# EAGLE design Adafruit Feather M0 Basic rev C (EAGLE 8.3.1)
COMPANY: ADAFRUIT INDUSTRIES; DRAWN: KTOWN; REV: B
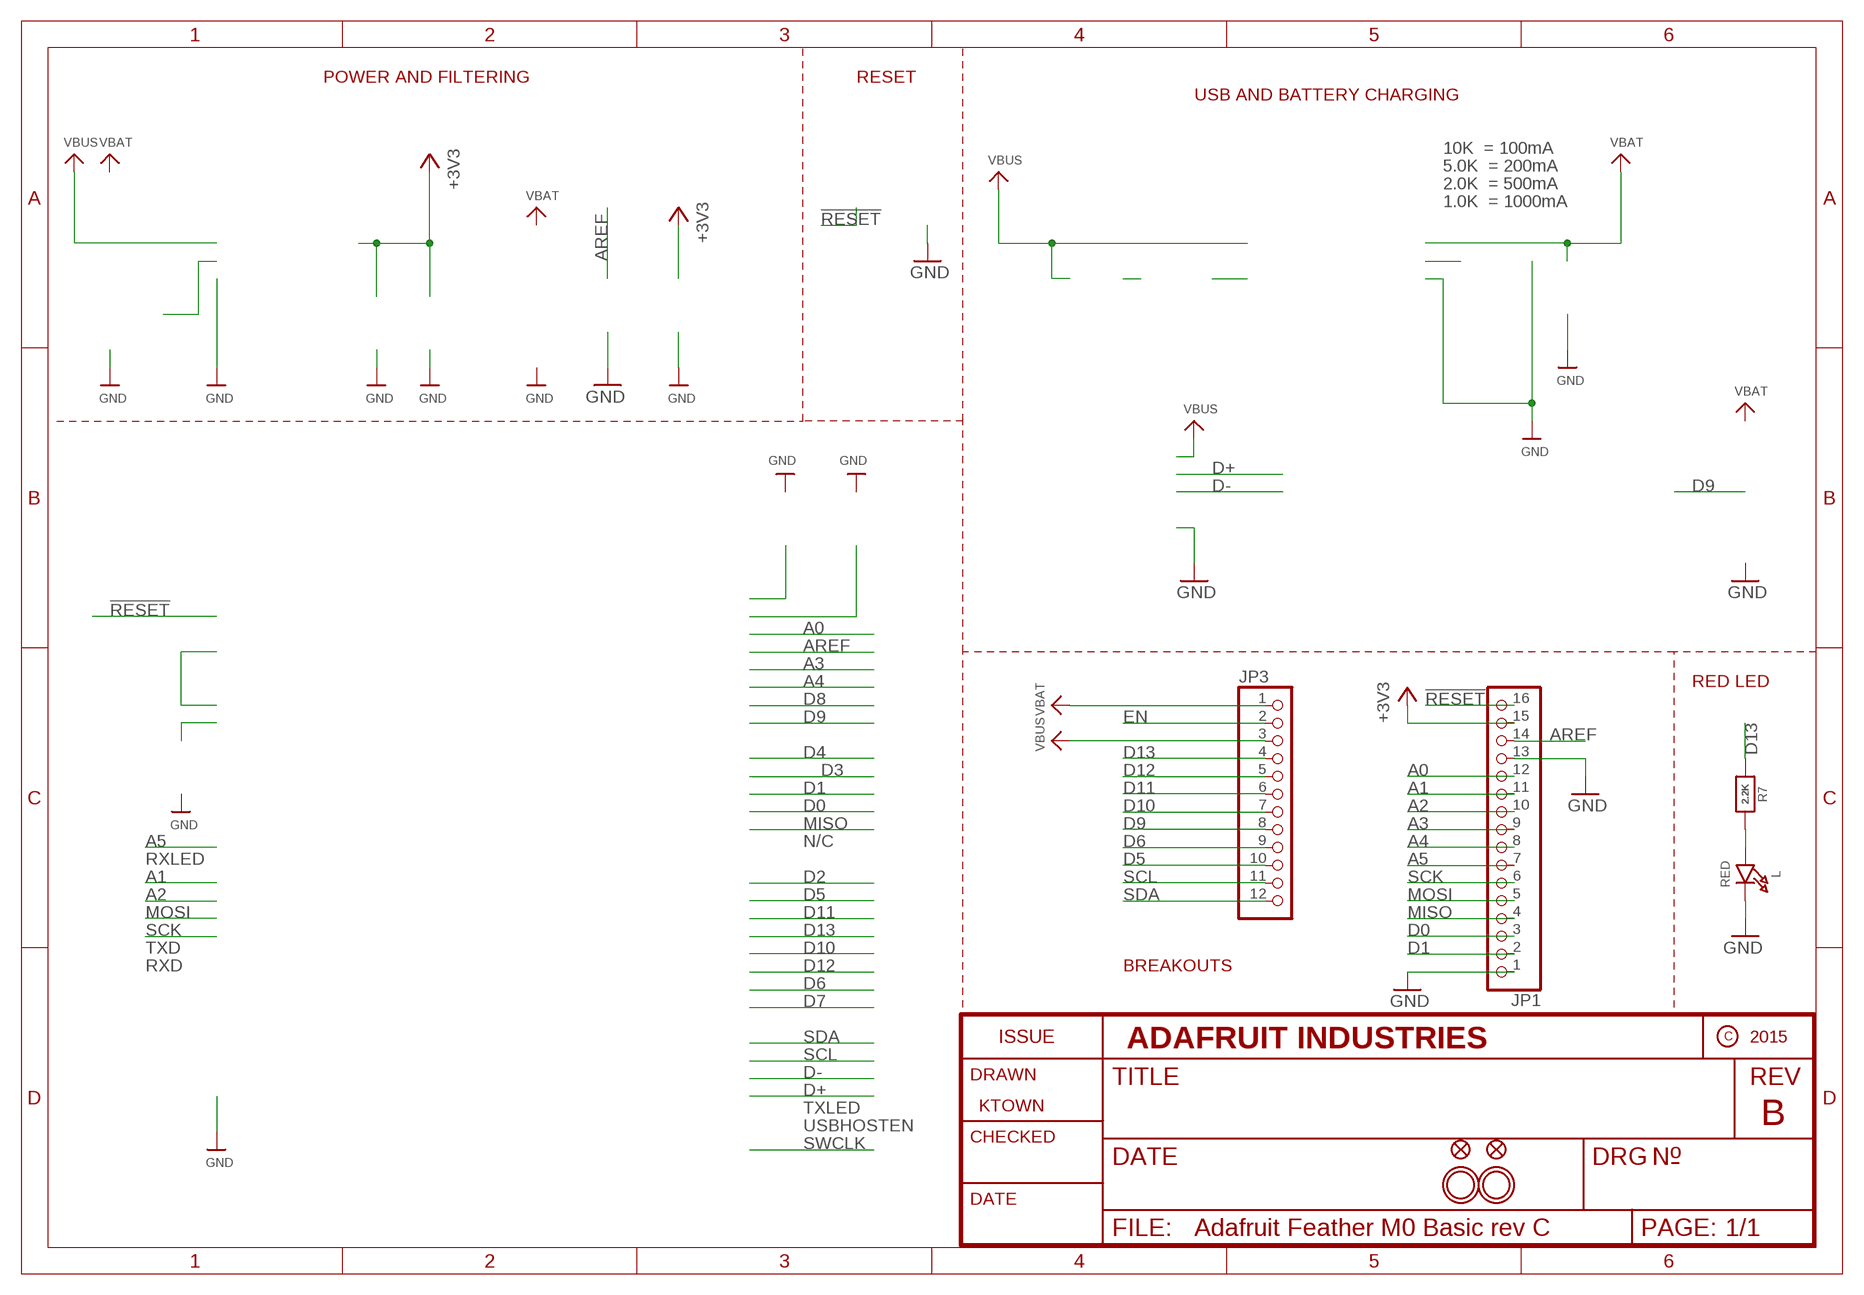
[diagram p0: schematic, sheet 1]

## Parts
JP1  HEADER-1X16ROUND  [1X16_ROUND]
JP3  HEADER-1X12  [1X12_ROUND]
L  RED  LED0805_NOOUTLINE  [CHIPLED_0805_NOOUTLINE]
R7  2.2K  RESISTOR_0603_NOOUT  [0603-NO]
U$31  MOUNTINGHOLE2.5  [MOUNTINGHOLE_2.5_PLATED]
U$32  MOUNTINGHOLE2.5  [MOUNTINGHOLE_2.5_PLATED]
U$34  FIDUCIAL""  [FIDUCIAL_1MM]
U$35  FIDUCIAL""  [FIDUCIAL_1MM]

## Nets
!RESET: JP1.16
+3V3: JP1.15
A0: JP1.12
A1: JP1.11
A2: JP1.10
A3: JP1.9
A4: JP1.8
A5: JP1.7
AREF: JP1.14
D0: JP1.3
D1: JP1.2
D5: JP3.10
D6: JP3.9
D9: JP3.8
D10: JP3.7
D11: JP3.6
D12: JP3.5
D13: JP3.4 R7.1
EN: JP3.2
GND: JP1.1 JP1.13 L.C
MISO: JP1.4
MOSI: JP1.5
N$2: L.A R7.2
SCK: JP1.6
SCL: JP3.11
SDA: JP3.12
VBAT: JP3.1
VBUS: JP3.3

## Notes on the sheet
- POWER AND FILTERING | RESET
- USB AND BATTERY CHARGING
- 10K  = 100mA
- 5.0K  = 200mA
- 2.0K  = 500mA
- 1.0K  = 1000mA
- RED LED
- N/C
- RXLED
- TXD
- RXD | BREAKOUTS
- TXLED
- USBHOSTEN

## Library data of the parts
JP1 = microbuilder:HEADER-1X16: PIN HEADER
JP3 = microbuilder:HEADER-1X12
L = microbuilder:LED: LED 0603 - 0603 Surface Mount Package 2mA: Green LED - Low Power (3.9mcd, 2ma, 1.7Vf) - Digikey: 475-2709-2-ND Orange LED - Low Power (9.8mcd, 2ma, 1.8Vf) - Digikey: 475-1194-2-ND Red LED - Low Power (5mcd, 2ma, 1.8Vf) - Digikey: 475-1195-2-ND Yellow LED - Low Power (7mcd, 2ma, 1.8Vf) - Digikey: 475-1196-2-ND 5mA: Blue LED - Low Power (17mcd, 5ma, 2.9Vf) - Digikey: LNJ937W8CRACT-ND 0805 - 0805 Surface Mount Package 2mA: Red LED (8.8mcd, 2mA, 1.8Vf, Clear) - Low Power [Digikey: 475-2510-1-ND] Green LED (5mcd, 2mA, 1.8Vf, Clear) - Low Power [Digikey: 475-2730-1-ND] Yellow LED (11.3mcd, 2mA, 1.8Vf, Clear) - Low Power [Digikey: 475-2555-1-ND] 20mA: Red LED (104mcd, 20mA, Diffused) - LS R976 [Digikey: 475-1278-6-ND] Red LED (12mcd, 20mA, 2.0Vf, Clear) - APT2012EC [Digikey: 754-1128-1-ND] Green LED (15mcd, 20mA, 2.2Vf, Clear) - APT2012GC [Digikey: 754-1131-1-ND] Orange LED (160mcd, 20mA, 2.1Vf, Clear) - APT2012SECK [Digikey: 754-1130-1-ND] 1206 - 1206 Surface Mount Package Green LED (26mcd, 20mA, Diffused) - LG N971 [Digikey: 475-1407-6-ND] Red LED (15mcd, 20mA, Diffused) - LH N974 [Digikey: 475-1416-6-ND] Cree - Cree High-Power Surface Mount LEDs XPEBWT-L1-0000-00D50 - White 111lm 350mA 2.9Vf 6200K 110° XTEAWT-00-0000-00000LEE3 - White 114lm 350mA 2.85Vf 5000K 115° Everlight - Everlight 45-21 Series Surface Mount LEDs 45-21/QK2C-B2832AC2CB2/2T - Warm White 2000mcd 20mA 3.25Vf 3050K 120° 45-21/LK2C-B38452C4CB2/2T - Nuetral White 2000mcd 20mA 3.25Vf 4150K 120° 45-21/LK2C-B50634C6CB2/2T - Cold White 2200mcd 20mA 3.25Vf 5650K 120° PLCC2 Reverse Mount LS T77K-J1L2-1-0-2-R18-Z - Red 11.25mcd 2mA 1.8Vf 630nm 120° LO T77K-L1M2-24-Z - Orange 19.6mcd 2mA 1.8Vf 606nm 120° LY T77K-K2M1-26-Z - Yellow 15.7mcd 2mA 1.8Vf 587nm 120°
R7 = microbuilder:RESISTOR: Resistors For new designs, use the packages preceded by an '_' character since they are more reliable: The following footprints should be used on most boards: _0402 - Standard footprint for regular board layouts _0603 - Standard footprint for regular board layouts _0805 - Standard footprint for regular board layouts _1206 - Standard footprint for regular board layouts For extremely tight-pitch boards where space is at a premium, the following 'micro-pitch' footprints can be used (smaller pads, no silkscreen outline, etc.): _0402MP - Micro-pitch footprint for very dense/compact boards _0603MP - Micro-pitch footprint for very dense/compact boards _0805MP - Micro-pitch footprint for very dense/compact boards _1206MP - Micro-pitch footprint for very dense/compact boards
U$31 U$32 = microbuilder:MOUNTINGHOLE: Mounting Hole For #2 screws (0.086"/2.18mm width, 0.094"/2.4mm hole) use 2.5mm; BOM: EXCLUDE
U$34 U$35 = microbuilder:FIDUCIAL: Fiducial Alignment Points Various fiducial points for machine vision alignment.; BOM: EXCLUDE

## Board
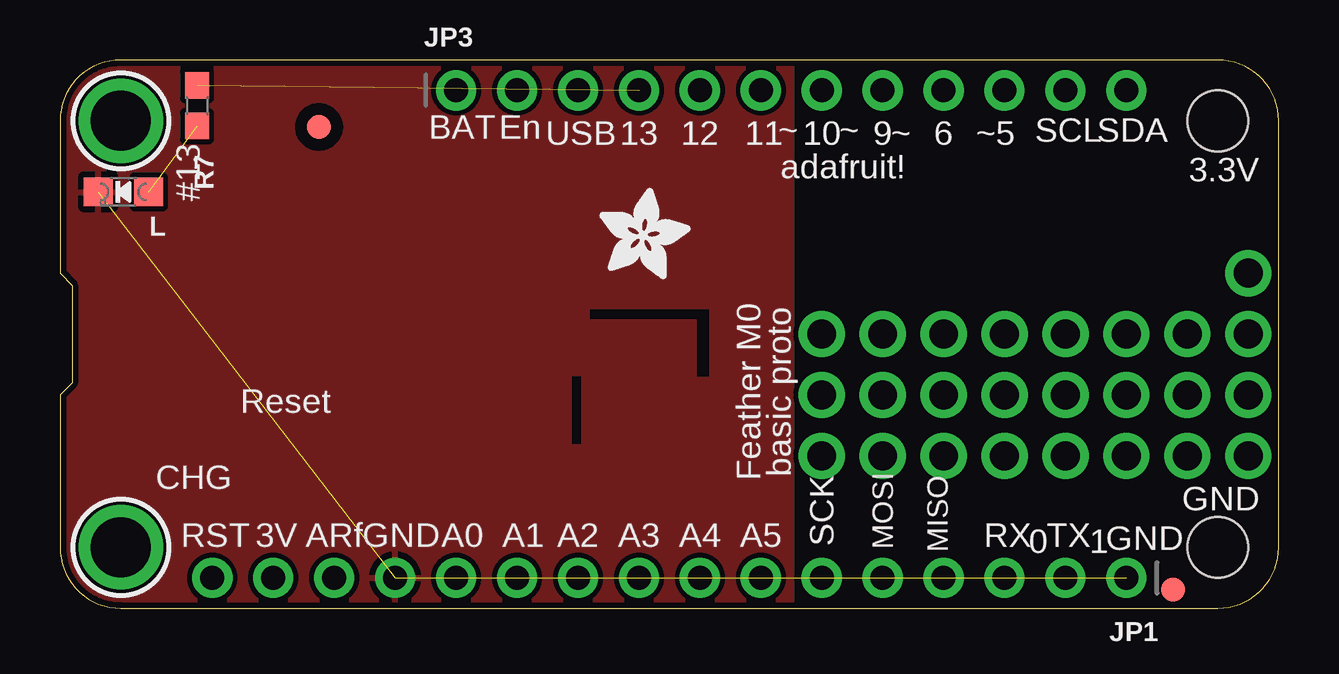
[diagram p1: board, top side]
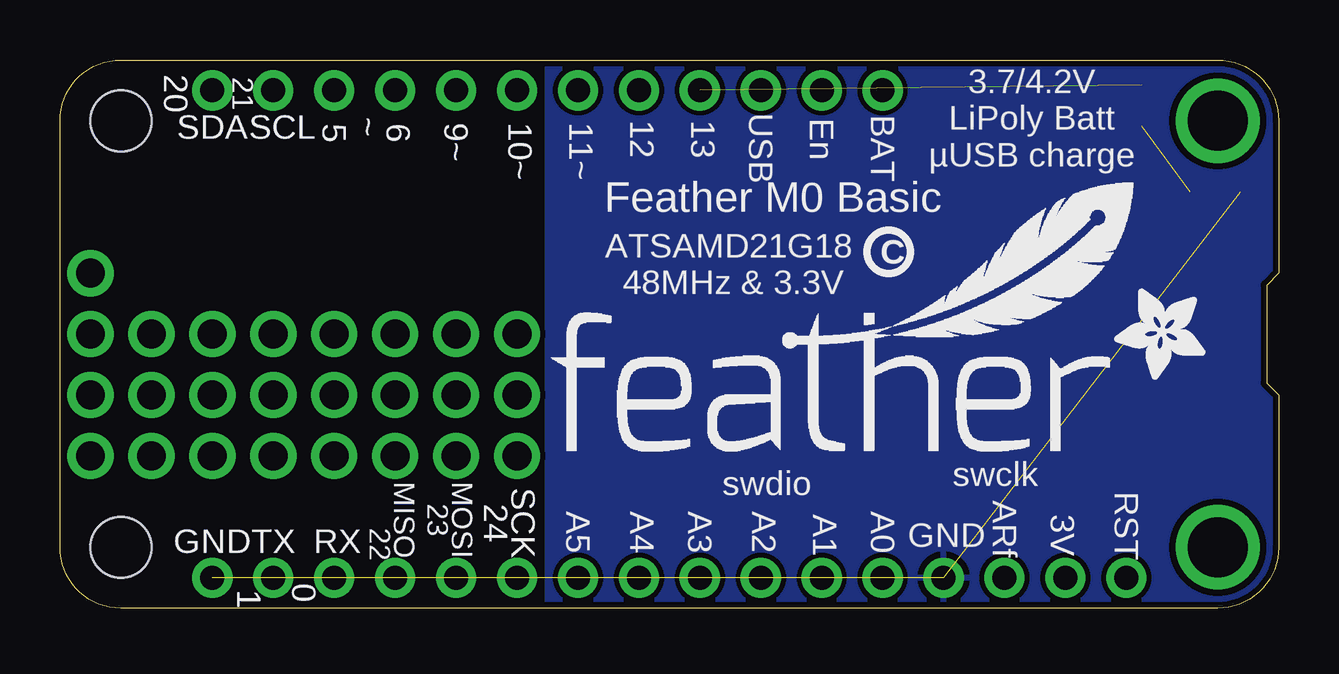
[diagram p2: board, bottom side, seen from below]

Size 50.8 x 22.86 mm. Coordinates in mm from the lower left corner, seen from the top.
Outline: 2.54,0 48.26,0 arc90 50.8,2.54 50.8,20.32 arc90 48.26,22.86 2.54,22.86 arc90 0,20.32 0,13.97 0.51,13.46 0.51,9.4 0,8.89 0,2.54 arc90 2.54,0
Copper layers (1*16): Top 0.035mm / dielectric 1.5mm / Bottom 0.035mm
Design rules "adafruit *": minimum track width 8mil, minimum drill 15.5mil, track to track 8mil, track to pad 8mil, pad to pad 8mil, via to via 8mil, smd to smd 8mil, copper to edge 10mil, drill to drill 8mil, minimum pad ring 10mil, minimum via ring 8mil, stop-mask expansion 2mil, vias tented up to drill 20mil, thermal gap 10mil
Holes 2.54 mm at 48.26,20.32 48.26,2.54
tRestrict: area 21.3,6.9 to 21.7,9.7; area 22.1,12.1 to 27.1,12.4; area 26.5,9.7 to 27.1,12.2

### Footprints (pad centres in the part's own frame; a part is rotated, then mirrored left to right if it is on the bottom)
1X16_ROUND = drill 1 pad 1.676: 1 -19.05,0; 2 -16.51,0; 3 -13.97,0; 4 -11.43,0; 5 -8.89,0; 6 -6.35,0; 7 -3.81,0; 8 -1.27,0; 9 1.27,0; 10 3.81,0; 11 6.35,0; 12 8.89,0; 13 11.43,0; 14 13.97,0; 15 16.51,0; 16 19.05,0
1X12_ROUND = drill 1 pad 1.676: 1 -13.97,0; 2 -11.43,0; 3 -8.89,0; 4 -6.35,0; 5 -3.81,0; 6 -1.27,0; 7 1.27,0; 8 3.81,0; 9 6.35,0; 10 8.89,0; 11 11.43,0; 12 13.97,0
CHIPLED_0805_NOOUTLINE = smd 1.2 x 1.2: A 0,-1.05; C 0,1.05
0603-NO = smd 1.1 x 1: 1 -0.85,0; 2 0.85,0
MOUNTINGHOLE_2.5_PLATED = drill 2.5 pad 3.2: P$1 0,0
FIDUCIAL_1MM = smd 1 x 1: 1 0,0

### Placement (x,y rotation side)
JP1  25.4,1.27 180 top
JP3  30.48,21.59 0 top
L  2.65,17.36 90 top
R7  5.71,20.95 270 top
U$7  [ADAFRUIT_3.5MM]  22.48,13.72 0 top
U$9  [FEATHERLOGO]  30.35,6.48 0 bottom
U$12  [ADAFRUIT_3.5MM]  3.05,13.34 180 bottom
U$13  [PCBFEAT-REV-040]  16.26,14.86 0 bottom
U$31  2.54,20.32 270 top
U$32  2.54,2.54 270 top
U$34  10.79,20.07 270 top
U$35  46.4,0.77 270 top

### Tracks (layer width: path | path; a pad name or v marks a point on that pad's centre or on a via)
D13  (1 unrouted)
GND  (2 unrouted)
  pour Top: 0,22.86 0,0 30.48,0 30.48,22.86
  pour Bottom: 30.48,0 0,0 0,22.86 30.48,22.86
N$2  (1 unrouted)
N$6  (via drill 1.2 pad 1.93)
  other vias: 31.75,8.89
N$13  (via drill 1.2 pad 1.93)
  other vias: 49.53,13.97
N$14  (via drill 1.2 pad 1.93)
  other vias: 49.53,11.43
N$15  (via drill 1.2 pad 1.93)
  other vias: 49.53,8.89
N$16  (via drill 1.2 pad 1.93)
  other vias: 46.99,8.89
N$17  (via drill 1.2 pad 1.93)
  other vias: 46.99,11.43
N$18  (via drill 1.2 pad 1.93)
  other vias: 44.45,11.43
N$19  (via drill 1.2 pad 1.93)
  other vias: 44.45,8.89
N$20  (via drill 1.2 pad 1.93)
  other vias: 44.45,6.35
N$21  (via drill 1.2 pad 1.93)
  other vias: 46.99,6.35
N$22  (via drill 1.2 pad 1.93)
  other vias: 31.75,6.35
N$24  (via drill 1.2 pad 1.93)
  other vias: 41.91,6.35
N$25  (via drill 1.2 pad 1.93)
  other vias: 41.91,8.89
N$26  (via drill 1.2 pad 1.93)
  other vias: 41.91,11.43
N$32  (via drill 1.2 pad 1.93)
  other vias: 39.37,11.43
N$33  (via drill 1.2 pad 1.93)
  other vias: 39.37,8.89
N$34  (via drill 1.2 pad 1.93)
  other vias: 39.37,6.35
N$35  (via drill 1.2 pad 1.93)
  other vias: 36.83,6.35
N$36  (via drill 1.2 pad 1.93)
  other vias: 36.83,8.89
N$37  (via drill 1.2 pad 1.93)
  other vias: 36.83,11.43
N$42  (via drill 1.2 pad 1.93)
  other vias: 34.29,11.43
N$43  (via drill 1.2 pad 1.93)
  other vias: 34.29,8.89
N$44  (via drill 1.2 pad 1.93)
  other vias: 34.29,6.35
N$45  (via drill 1.2 pad 1.93)
  other vias: 49.53,6.35
N$47  (via drill 1.2 pad 1.93)
  other vias: 31.75,11.43

### Text on the board
tPlace: BAT | En | USB | 13 | 12 | 11 | ~ | 10 | ~ | 9 | ~ | 6 | ~5 | SCL | SDA | #13 | adafruit! | 3.3V | Reset | Feather M0 | basic proto | CHG | GND | SCK | MOSI | MISO | RST | 3V | ARf | GND | A0 | A1 | A2 | A3 | A4 | A5 | RX | 0 | TX | 1 | GND
bPlace: 21 | 20 | 3.7/4.2V / LiPoly Batt / µUSB charge | En | 13 | 12 | 6 | ~ | 5 | SCL | SDA | BAT | USB | 11~ | 10~ | 9~ | Feather M0 Basic | ATSAMD21G18 / 48MHz & 3.3V | swclk | swdio | SCK | 24 | MOSI | 23 | MISO | RST | 3V | ARf | GND | A0 | A1 | A2 | A3 | A4 | A5 | 22 | RX | TX | GND | 0 | 1